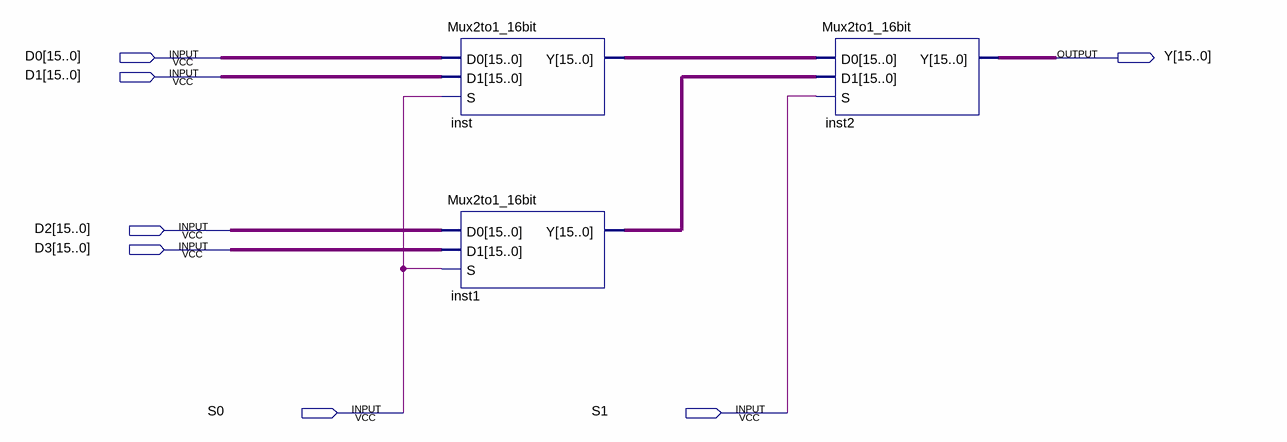
[diagram p0: schematic sheet]
// Quartus schematic Mux4to1_16bit.bdf as structural Verilog: 3 symbols, 7 pins
module Mux4to1_16bit (
  input  [15:0] D0,
  input  [15:0] D1,
  input  [15:0] D2,
  input  [15:0] D3,
  input  S0,
  input  S1,
  output [15:0] Y
);

  wire [15:0] inst1_y, inst_y;

  Mux2to1_16bit inst (.D0(D0), .D1(D1), .S(S0), .Y(inst_y));
  Mux2to1_16bit inst1 (.D0(D2), .D1(D3), .S(S0), .Y(inst1_y));
  Mux2to1_16bit inst2 (.D0(inst_y), .D1(inst1_y), .S(S1), .Y(Y));
endmodule
